# EAGLE schematic WiazkaSwiatlaDzienne (EAGLE 7.7.0)
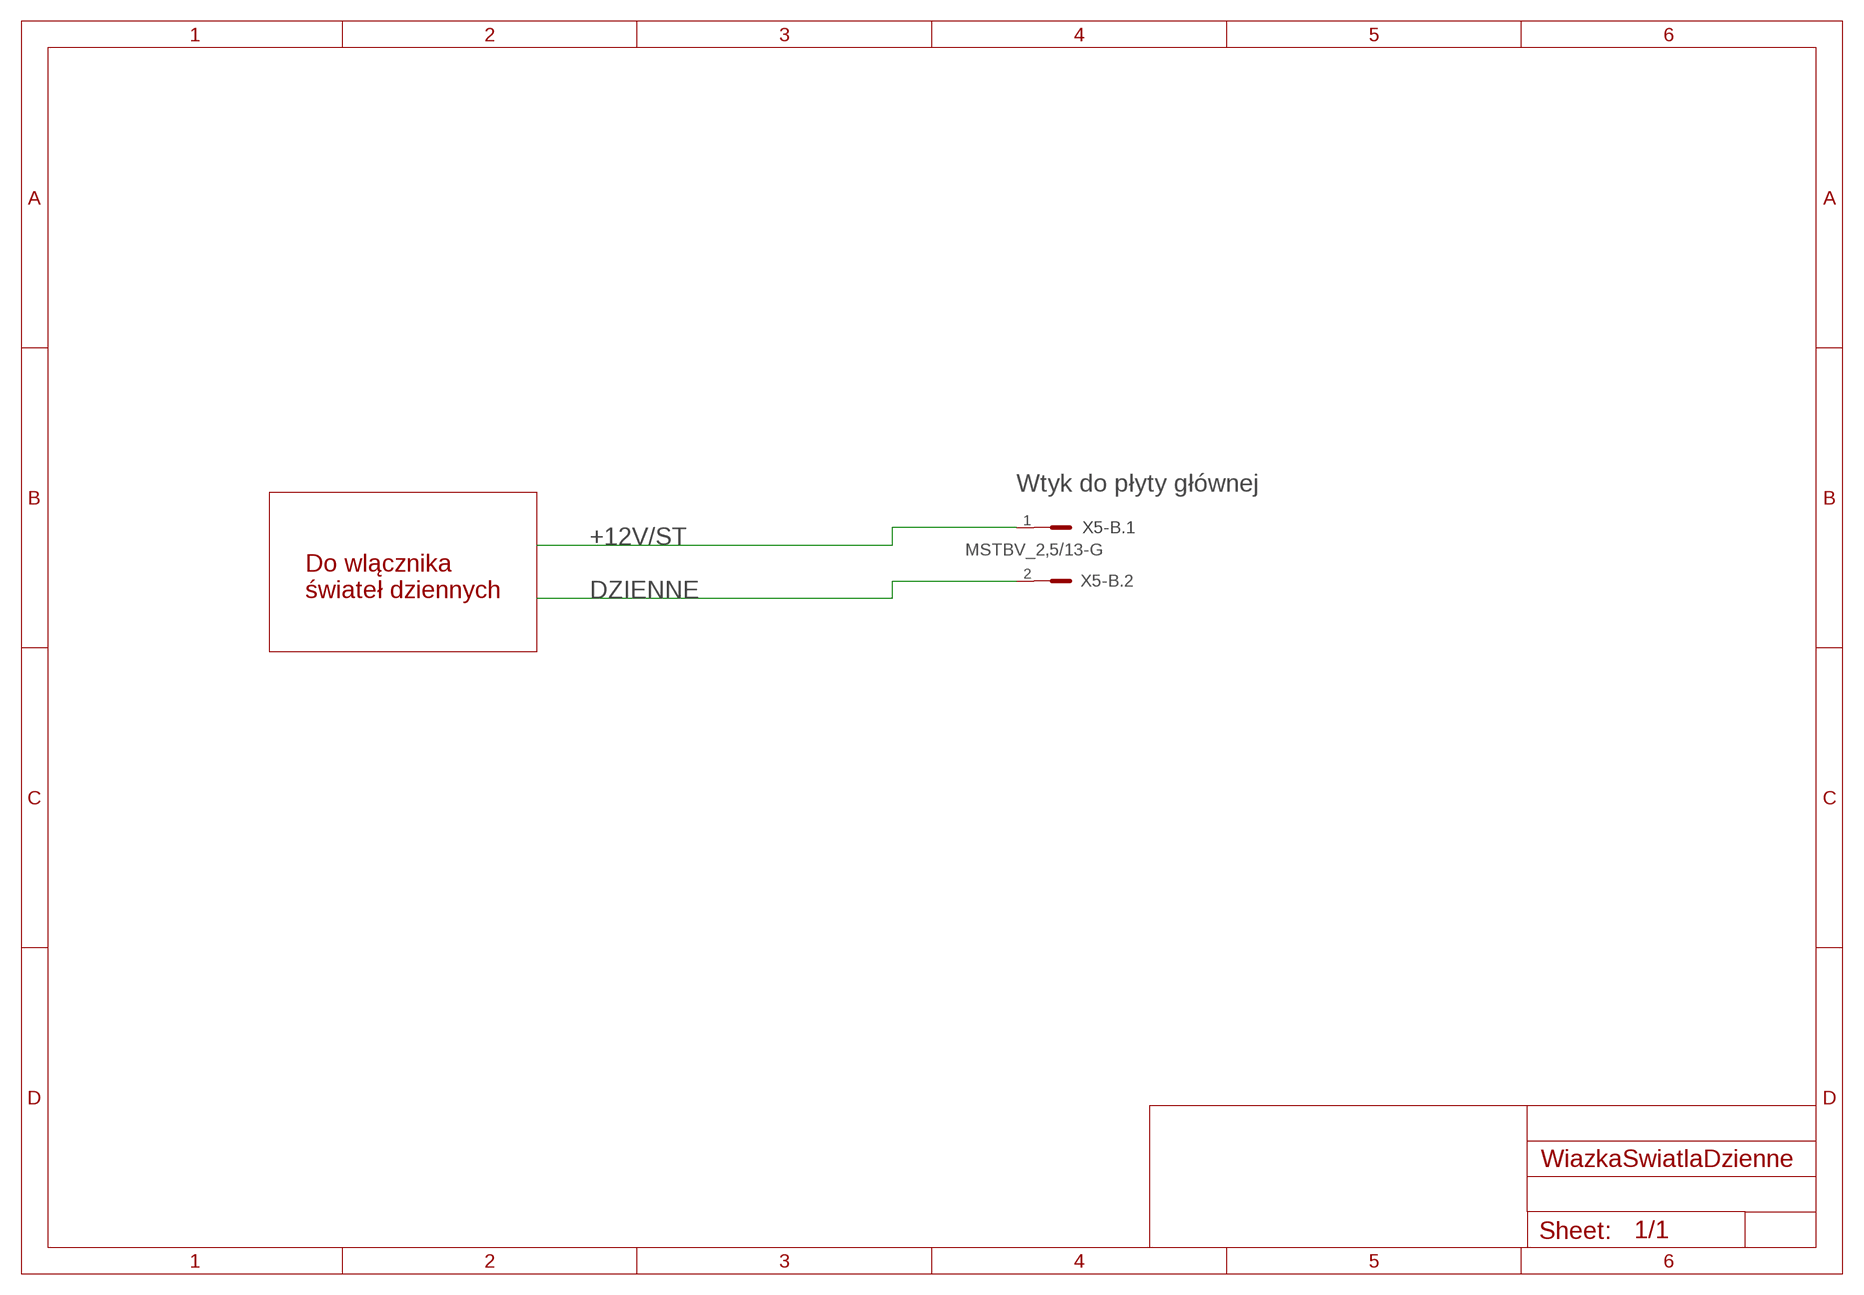
[diagram p0: schematic, sheet 1]

## Parts
X5-B  MSTBV_2,5/13-G  [MSTBV_2,5/13-G]

## Nets
+12V/ST: X5-B.1
DZIENNE: X5-B.2
Unconnected: X5-B.3 X5-B.4 X5-B.5 X5-B.6 X5-B.7 X5-B.8 X5-B.9 X5-B.10 X5-B.11 X5-B.12 X5-B.13

## Notes on the sheet
- Wtyk do płyty głównej
- Do wlącznika
  świateł dziennych

## Library data of the parts
X5-B = con-phoenix-500:MSTBV_2,5/13-G: Grundleiste - MSTBV 2,5/13-G - 1753657 Grundgehäuse, Nennstrom: 12 A Bemessungsspannung (III/2): 320 V Polzahl: 13 Rastermaß: 5 mm Farbe: grün Kontaktoberfläche: Zinn Montage: Löten